# EAGLE schematic SCHEMATIC_R1 (EAGLE 9.6.2)
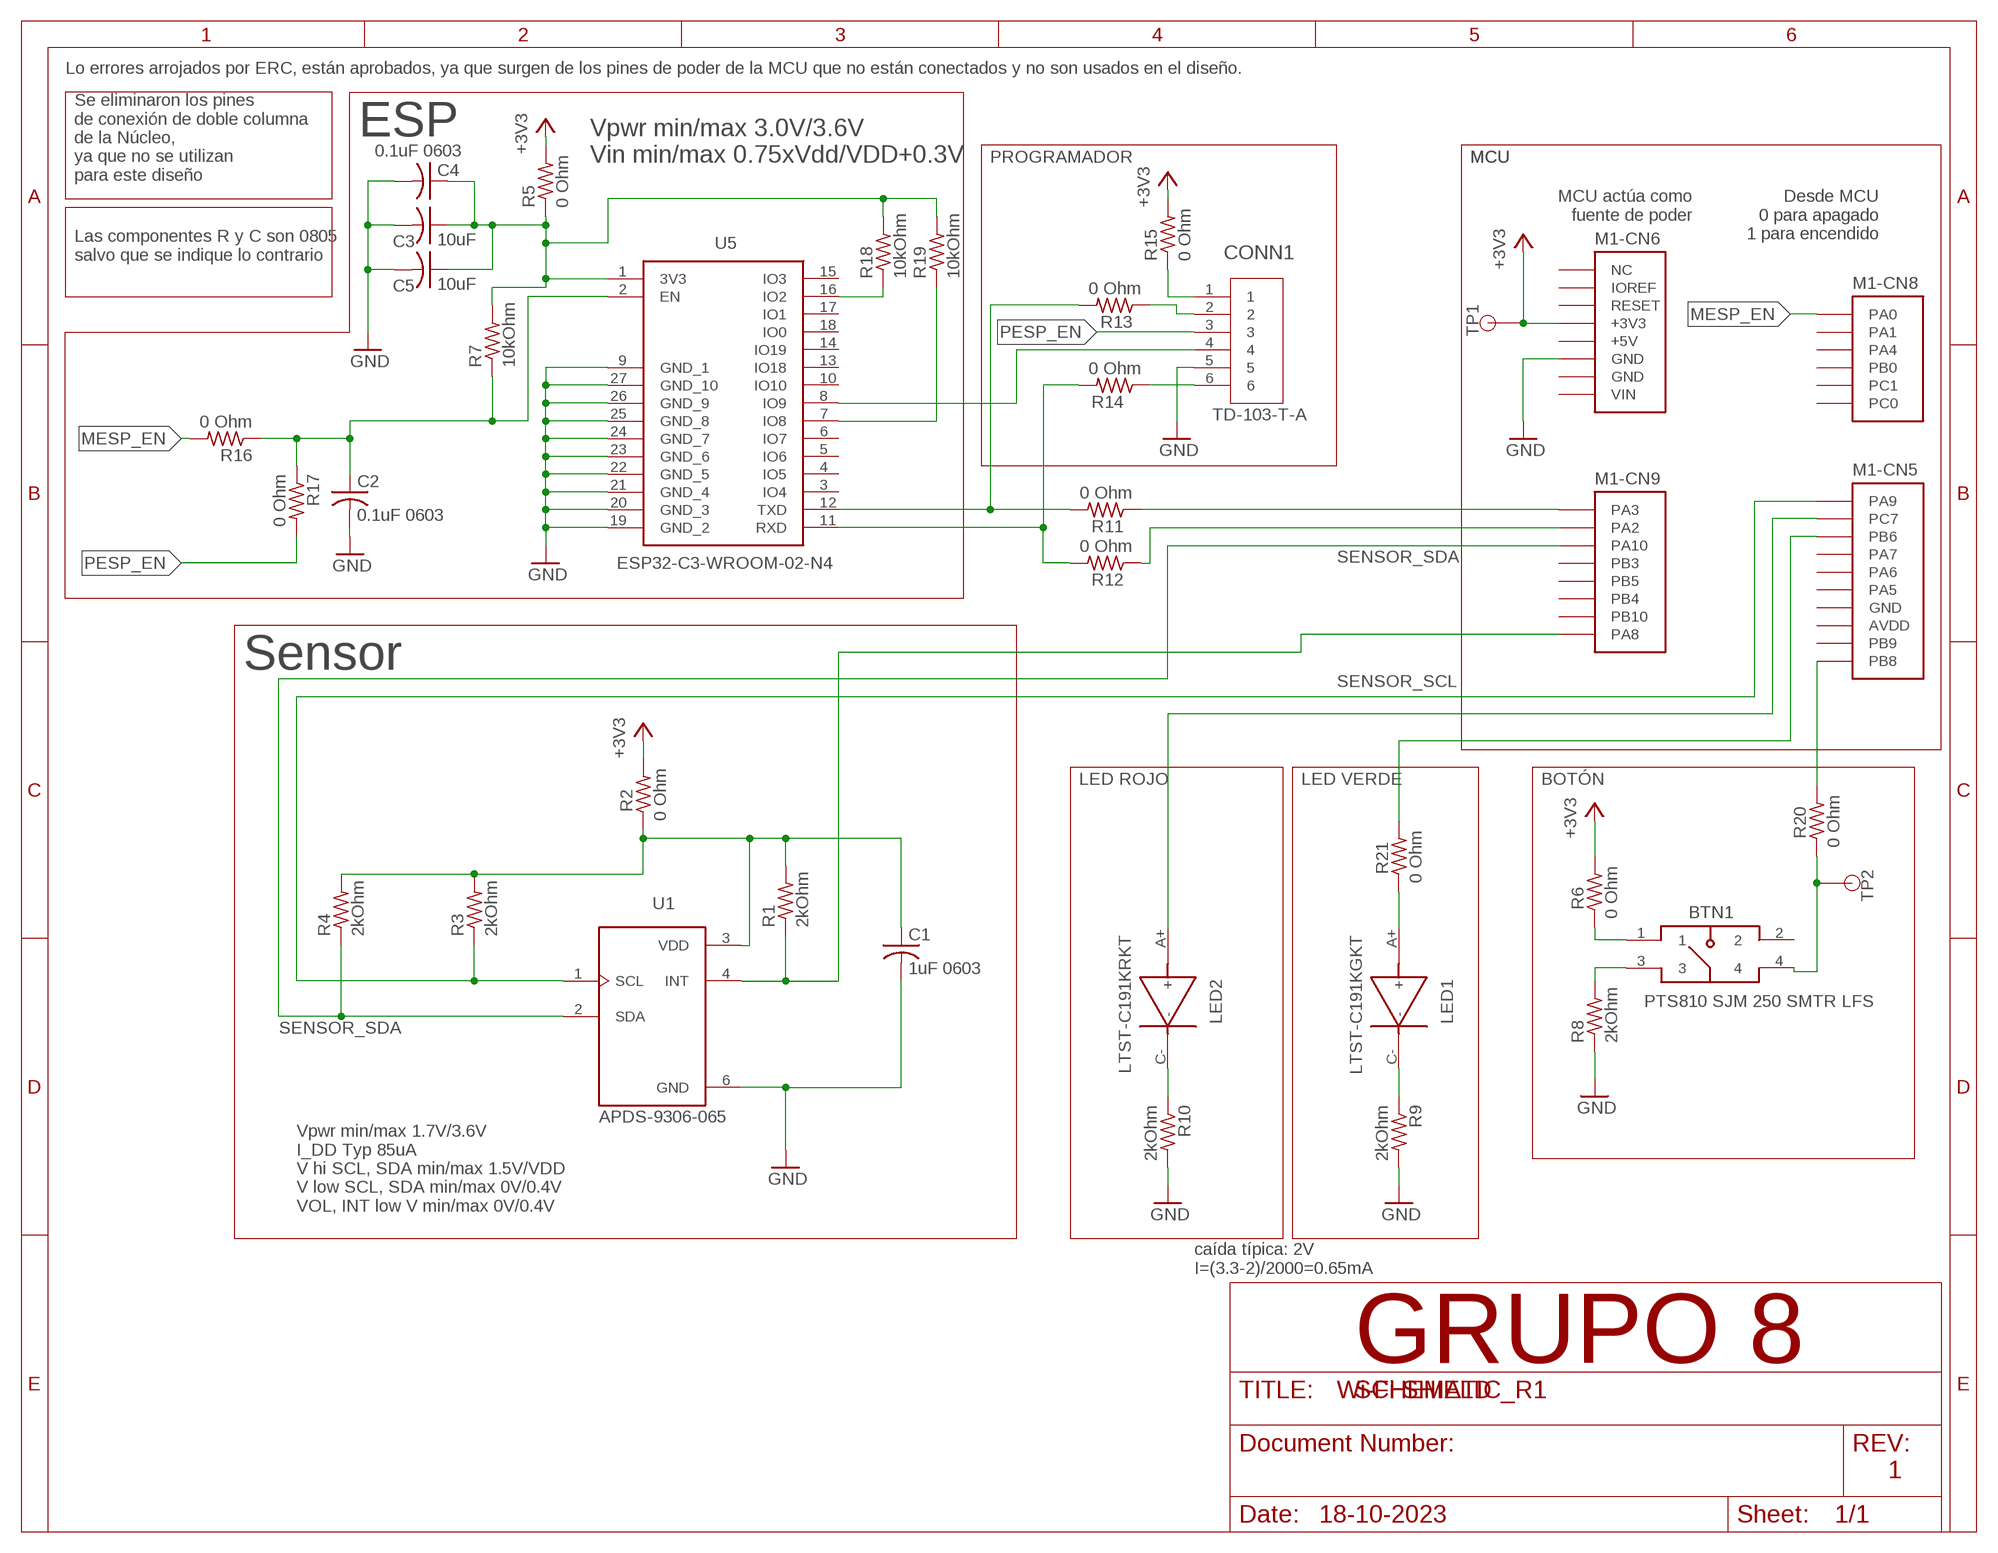
[diagram p0: schematic, sheet 1]

## Parts
BTN1  PTS810 SJM 250 SMTR LFS  PTS810SJM250SMTRLFS  [PTS810]
C1  1uF 0603  C-USC0603  [C0603]
C2  0.1uF 0603  C-USC0603  [C0603]
C3  10uF  C-USC0805  [C0805]
C4  0.1uF 0603  C-USC0603  [C0603]
C5  10uF  C-USC0805  [C0805]
CONN1  TD-103-T-A  TD-103-T-ACON6_2X3_TU_HTS_SAI  [CON6_2X3_TU_HTS_SAI]
LED1  LTST-C191KGKT  LTST-C191KRKT  [0603]
LED2  LTST-C191KRKT  [0603]
M1  NUCLEO-L452RE  [NUCLEO-64]
R1  2kOhm  R-US_M0805  [M0805]
R2  0 Ohm  R-US_M0805  [M0805]
R3  2kOhm  R-US_M0805  [M0805]
R4  2kOhm  R-US_M0805  [M0805]
R5  0 Ohm  R-US_M0805  [M0805]
R6  0 Ohm  R-US_M0805  [M0805]
R7  10kOhm  R-US_R0805  [R0805]
R8  2kOhm  R-US_M0805  [M0805]
R9  2kOhm  R-US_M0805  [M0805]
R10  2kOhm  R-US_M0805  [M0805]
R11  0 Ohm  R-US_M0805  [M0805]
R12  0 Ohm  R-US_M0805  [M0805]
R13  0 Ohm  R-US_M0805  [M0805]
R14  0 Ohm  R-US_M0805  [M0805]
R15  0 Ohm  R-US_M0805  [M0805]
R16  0 Ohm  R-US_M0805  [M0805]
R17  0 Ohm  R-US_M0805  [M0805]
R18  10kOhm  R-US_R0805  [R0805]
R19  10kOhm  R-US_R0805  [R0805]
R20  0 Ohm  R-US_M0805  [M0805]
R21  0 Ohm  R-US_M0805  [M0805]
TP1  TESTPOINT  [TESTPOINT]
TP2  TESTPOINT  [TESTPOINT]
U1  APDS-9306-065  [SON65P200X200X75-6N]
U5  ESP32-C3-WROOM-02-N4  [ESP32C3WROOM02N4]

## Nets
+3V3: M1.CN6-4(-CN6:+3V3) R2.2 R5.2 R6.2 R15.2 TP1.TP
GND: C1.2 C2.2 C3.2 C4.2 C5.2 CONN1.5 M1.CN6-6(-CN6:GND) R8.1 R9.2 R10.2 U1.6(GND) U5.9(GND_1) U5.19(GND_2) U5.20(GND_3) U5.21(GND_4) U5.22(GND_5) U5.23(GND_6) U5.24(GND_7) U5.25(GND_8) U5.26(GND_9) U5.27(GND_10)
MESP_EN: M1.CN8-1(-CN8:PA0) R16.2
N$1: M1.CN5-10(-CN5:PB8) R20.2
N$2: C1.1 R1.2 R2.1 R3.2 R4.2 U1.3(VDD)
N$3: M1.CN9-8(-CN9:PA8) R1.1 U1.4(INT)
N$4: LED2.A+(+) M1.CN5-2(-CN5:PC7)
N$5: BTN1.3 R8.2
N$6: R18.1 U5.16(IO2)
N$7: BTN1.1 R6.1
N$8: M1.CN9-1(-CN9:PA3) R11.1
N$9: M1.CN9-2(-CN9:PA2) R12.1
N$10: BTN1.4 R20.1 TP2.TP
N$11: M1.CN5-3(-CN5:PB6) R21.2
N$12: LED2.C-(-) R10.1
N$13: R11.2 R13.2 U5.12(TXD)
N$14: LED1.C-(-) R9.1
N$15: R12.2 R14.2 U5.11(RXD)
N$16: CONN1.2 R13.1
N$17: CONN1.6 R14.1
N$18: CONN1.4 U5.8(IO9)
N$19: CONN1.1 R15.1
N$20: R19.1 U5.7(IO8)
N$21: C2.1 R7.1 R16.1 R17.1 U5.2(EN)
N$22: C3.1 C4.1 C5.1 R5.1 R7.2 R18.2 R19.2 U5.1(3V3)
N$23: LED1.A+(+) R21.1
PESP_EN: CONN1.3 R17.2
SENSOR_SCL: M1.CN5-1(-CN5:PA9) R3.1 U1.1(SCL)
SENSOR_SDA: M1.CN9-3(-CN9:PA10) R4.1 U1.2(SDA)
Unconnected: BTN1.2 M1.CN5-4(-CN5:PA7) M1.CN5-5(-CN5:PA6) M1.CN5-6(-CN5:PA5) M1.CN5-9(-CN5:PB9) M1.CN6-1(-CN6:NC) M1.CN6-3(-CN6:RESET) M1.CN7-1(-CN7:PC10) M1.CN7-2(-CN7:PC11) M1.CN7-3(-CN7:PC12) M1.CN7-4(-CN7:PD2) M1.CN7-6(-CN7:E5V) M1.CN7-7(-CN7:BOOT0) M1.CN7-9(-CN7:NC) M1.CN7-10(-CN7:NC) M1.CN7-11(-CN7:NC) M1.CN7-12(-CN7:IOREF) M1.CN7-13(-CN7:PA13) M1.CN7-14(-CN7:RESET) M1.CN7-15(-CN7:PA14) M1.CN7-17(-CN7:PA15) M1.CN7-21(-CN7:PB7) M1.CN7-23(-CN7:PC13) M1.CN7-25(-CN7:PC14) M1.CN7-26(-CN7:NC) M1.CN7-27(-CN7:PC15) M1.CN7-28(-CN7:PA0) M1.CN7-29(-CN7:PH0) M1.CN7-30(-CN7:PA1) M1.CN7-31(-CN7:PH1) M1.CN7-32(-CN7:PA4) M1.CN7-34(-CN7:PB0) M1.CN7-35(-CN7:PC2) M1.CN7-36(-CN7:PC1) M1.CN7-37(-CN7:PC3) M1.CN7-38(-CN7:PC0) M1.CN8-2(-CN8:PA1) M1.CN8-3(-CN8:PA4) M1.CN8-4(-CN8:PB0) M1.CN8-5(-CN8:PC1) M1.CN8-6(-CN8:PC0) M1.CN9-4(-CN9:PB3) M1.CN9-5(-CN9:PB5) M1.CN9-6(-CN9:PB4) M1.CN9-7(-CN9:PB10) M1.CN10-1(-CN10:PC9) M1.CN10-2(-CN10:PC8) M1.CN10-3(-CN10:PB8) M1.CN10-4(-CN10:PC6) M1.CN10-5(-CN10:PB9) M1.CN10-6(-CN10:PC5) M1.CN10-10(-CN10:NC) M1.CN10-11(-CN10:PA5) M1.CN10-12(-CN10:PA12) M1.CN10-13(-CN10:PA6) M1.CN10-14(-CN10:PA11) M1.CN10-15(-CN10:PA7) M1.CN10-16(-CN10:PB12) M1.CN10-17(-CN10:PB6) M1.CN10-18(-CN10:PB11) M1.CN10-19(-CN10:PC7) M1.CN10-21(-CN10:PA9) M1.CN10-22(-CN10:PB2) M1.CN10-23(-CN10:PA8) M1.CN10-24(-CN10:PB1) M1.CN10-25(-CN10:PB10) M1.CN10-26(-CN10:PB15) M1.CN10-27(-CN10:PB4) M1.CN10-28(-CN10:PB14) M1.CN10-29(-CN10:PB5) M1.CN10-30(-CN10:PB13) M1.CN10-31(-CN10:PB3) M1.CN10-33(-CN10:PA10) M1.CN10-34(-CN10:PC4) M1.CN10-35(-CN10:PA2) M1.CN10-36(-CN10:NC) M1.CN10-37(-CN10:PA3) M1.CN10-38(-CN10:NC) U5.3(IO4) U5.4(IO5) U5.5(IO6) U5.6(IO7) U5.10(IO10) U5.13(IO18) U5.14(IO19) U5.15(IO3) U5.17(IO1) U5.18(IO0)

## Notes on the sheet
- Lo errores arrojados por ERC, están aprobados, ya que surgen de los pines de poder de la MCU que no están conectados y no son usados en el diseño.
- ESP
- Vpwr min/max 3.0V/3.6V
  Vin min/max 0.75xVdd/VDD+0.3V
- PROGRAMADOR | MCU | MCU
- Se eliminaron los pines
  de conexión de doble columna
  de la Núcleo,
  ya que no se utilizan
  para este diseño
- MCU actúa como
  fuente de poder
- Desde MCU
  0 para apagado
  1 para encendido
- Las componentes R y C son 0805 
  salvo que se indique lo contrario
- Sensor
- LED ROJO | LED VERDE | BOTÓN
- Vpwr min/max 1.7V/3.6V
  I_DD Typ 85uA 
  V hi SCL, SDA min/max 1.5V/VDD
  V low SCL, SDA min/max 0V/0.4V
  VOL, INT low V min/max 0V/0.4V
- caída típica: 2V
  I=(3.3-2)/2000=0.65mA
- GRUPO 8
- Wi-Fi SHIELD
- 1
- 18-10-2023

## Power pins joined to a net without a drawn wire
+3V3: M1.CN7-16(-CN7:+3V3)
+5V: M1.CN6-5(-CN6:+5V) M1.CN7-18(-CN7:+5V)
AGND: M1.CN10-32(-CN10:AGND)
AVDD: M1.CN5-8(-CN5:AVDD) M1.CN10-7(-CN10:AVDD)
GND: M1.CN5-7(-CN5:GND) M1.CN6-7(-CN6:GND) M1.CN7-8(-CN7:GND) M1.CN7-19(-CN7:GND) M1.CN7-20(-CN7:GND) M1.CN7-22(-CN7:GND) M1.CN10-9(-CN10:GND) M1.CN10-20(-CN10:GND)
IOREF: M1.CN6-2(-CN6:IOREF)
U5V: M1.CN10-8(-CN10:U5V)
VBAT: M1.CN7-33(-CN7:VBAT)
VDD: M1.CN7-5(-CN7:VDD)
VIN: M1.CN6-8(-CN6:VIN) M1.CN7-24(-CN7:VIN)

## Library data of the parts
BTN1 = PTS810_SJM_250_SMTR_LFS-C&K:PTS810SJM250SMTRLFS; PARTNO: PTS810 SJM 250 SMTR LFS
C1 = rcl:C-US: CAPACITOR, American symbol; PARTNO: GCM188R71C105KA64D; SPICEPREFIX: C
C2 C4 = rcl:C-US: CAPACITOR, American symbol; PARTNO: GRM188R72A104KA35D; SPICEPREFIX: C
C3 C5 = rcl:C-US: CAPACITOR, American symbol; SPICEPREFIX: C
CONN1 = TD-103-T-A:TD-103-T-A; COPYRIGHT: Copyright (C) 2023 Ultra Librarian. All rights reserved.; MANUFACTURER_PART_NUMBER: TD-103-T-A; MFR_NAME: Samtec Inc; PARTNO: TD-103-T-A
LED1 = LTST-C191KRKT-C&K:LTST-C191KRKT; PARTNO: LTST-C191KGKT
LED2 = LTST-C191KRKT-C&K:LTST-C191KRKT; PARTNO: LTST-C191KRKT
M1 = NUCLEO-L452RE:NUCLEO-L452RE: No existe un outline (Layer Dimension) para esta librería. En su lugar se utilizó una referencia en tDocu. Al momento de diseñar la tarjeta, el Dimension debe ser dibujado según los requerimientos del usuario, o simplemente copiar los contenidos del tDocu en Dimensions.
R1 R3 R4 R8-R10 = rcl:R-US_: RESISTOR, American symbol; PARTNO: RMCF0805FT2K00; SPICEPREFIX: R
R2 R5 R6 R11-R17 R20 R21 = rcl:R-US_: RESISTOR, American symbol; PARTNO: RMCF0805ZT0R00; SPICEPREFIX: R
R7 R18 R19 = rcl:R-US_: RESISTOR, American symbol; PARTNO: RMCF0805JT10K0; SPICEPREFIX: R
TP1 TP2 = TEST_POINT:TESTPOINT
U1 = APDS-9306-065 - Avago Technologies:APDS-9306-065: Digital Ambient Light Photo Sensor with I2C Output; MANUFACTURER: AVAGO TECHNOLOGIES; PARTNO: APDS-9306-065; STANDARD: IPC-7351B
U5 = ESP32-C3-WROOM-02-N4:ESP32-C3-WROOM-02-N4: WiFi Modules (802.11) (Engineering Samples) SMD module, ESP32-C3, 4MB SPI flash, PCB antenna, -40 C +85 C Source: Datasheet <https://www.mouser.ch/datasheet/2/891/Espressif_ESP32_C3_WROOM_02-2006871.pdf>; DESCRIPTION: WiFi Modules (802.11) (Engineering Samples) SMD module, ESP32-C3, 4MB SPI flash, PCB antenna, -40 C +85 C; HEIGHT: 3.35mm; MANUFACTURER_NAME: Espressif Systems; MANUFACTURER_PART_NUMBER: ESP32-C3-WROOM-02-N4; MOUSER_PART_NUMBER: 356-ESP32C3WROOM02N4; MOUSER_PRICE-STOCK: https://www.mouser.co.uk/ProductDetail/Espressif-Systems/ESP32-C3-WROOM-02-N4?qs=stqOd1AaK7%2FqjTZKEOgfUg%3D%3D; PARTNO: ESP32-C3-WROOM-02-N4